# EAGLE design doorbell20 (EAGLE 7.2.0)
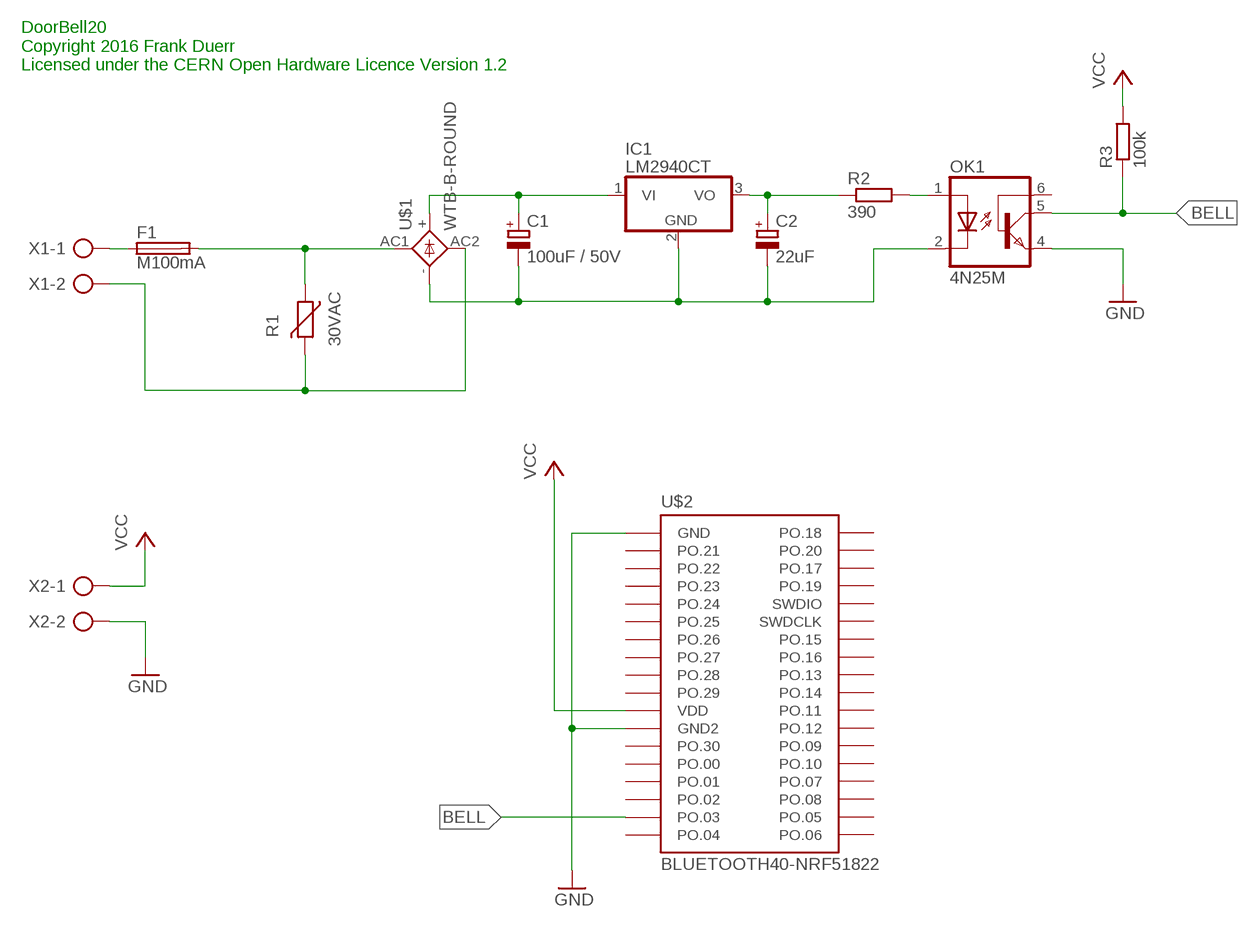
[diagram p0: schematic, sheet 1]

## Parts
C1  100uF / 50V  CPOL-EUE5-10.5  [E5-10,5]
C2  22uF  CPOL-EUE2.5-5  [E2,5-5]
F1  M100mA  FUSESH22,5A  [SH22,5A]
IC1  LM2940CT  7805TV  [TO220V]
OK1  4N25M  [DIL06]
R1  30VAC  VARISTOR-7,5  [R-7,5]
R2  390  R-EU_0207/7  [0207/7]
R3  100k  R-EU_0207/7  [0207/7]
U$1  WTB-B-ROUND  [WTE-B-ROUND]
U$2  BLUETOOTH40-NRF51822  [BLUETOOTH40-NR51822]
X1  AK500/2  [AK500/2]
X2  AK500/2  [AK500/2]

## Nets
BELL: OK1.5(COL) R3.1 U$2.PO.03
GND: OK1.4(EMI) U$2.GND U$2.GND2 X2.2
N$1: F1.1 X1.1
N$2: F1.2 R1.1 U$1.AC1
N$4: C1.- C2.- IC1.2(GND) OK1.2(C) U$1.-
N$5: C1.+ IC1.1(VI) U$1.+
N$6: OK1.1(A) R2.2
N$7: R1.2 U$1.AC2 X1.2
N$9: C2.+ IC1.3(VO) R2.1
VCC: R3.2 U$2.VDD X2.1
Unconnected: OK1.6(BAS) U$2.PO.00 U$2.PO.01 U$2.PO.02 U$2.PO.04 U$2.PO.05 U$2.PO.06 U$2.PO.07 U$2.PO.08 U$2.PO.09 U$2.PO.10 U$2.PO.11 U$2.PO.12 U$2.PO.13 U$2.PO.14 U$2.PO.15 U$2.PO.16 U$2.PO.17 U$2.PO.18 U$2.PO.19 U$2.PO.20 U$2.PO.21 U$2.PO.22 U$2.PO.23 U$2.PO.24 U$2.PO.25 U$2.PO.26 U$2.PO.27 U$2.PO.28 U$2.PO.29 U$2.PO.30 U$2.SWDCLK U$2.SWDIO

## Notes on the sheet
- DoorBell20
  Copyright 2016 Frank Duerr
  Licensed under the CERN Open Hardware Licence Version 1.2

## Library data of the parts
C1 C2 = rcl:CPOL-EU: POLARIZED CAPACITOR, European symbol
F1 = fuse:FUSE: Fuse; OC_FARNELL: unknown; OC_NEWARK: unknown
IC1 = linear:78*: Positive VOLTAGE REGULATOR Source: http://cache.national.com/ds/LM/LM78L05.pdf http://www.fairchildsemi.com/ds/LM/LM7805.pdf
OK1 = optocoupler:4N*?M: General Purpose 6-Pin Phototransistor Optocouplers Source: http://www.fairchildsemi.com/ds/4N/4N35-M.pdf; MPN: 4N25-M; OC_FARNELL: 1021349; OC_NEWARK: 98K9084
R1 = varistor:VARISTOR: VARISTOR
R2 R3 = rcl:R-EU_: RESISTOR, European symbol
U$1 = WTE-B:WTB-B-ROUND
U$2 = bluetooth40-nrf51822:BLUETOOTH40-NRF51822
X1 X2 = con-ptr500:AK500/2: CONNECTOR; OC_FARNELL: unknown; OC_NEWARK: unknown

## Board
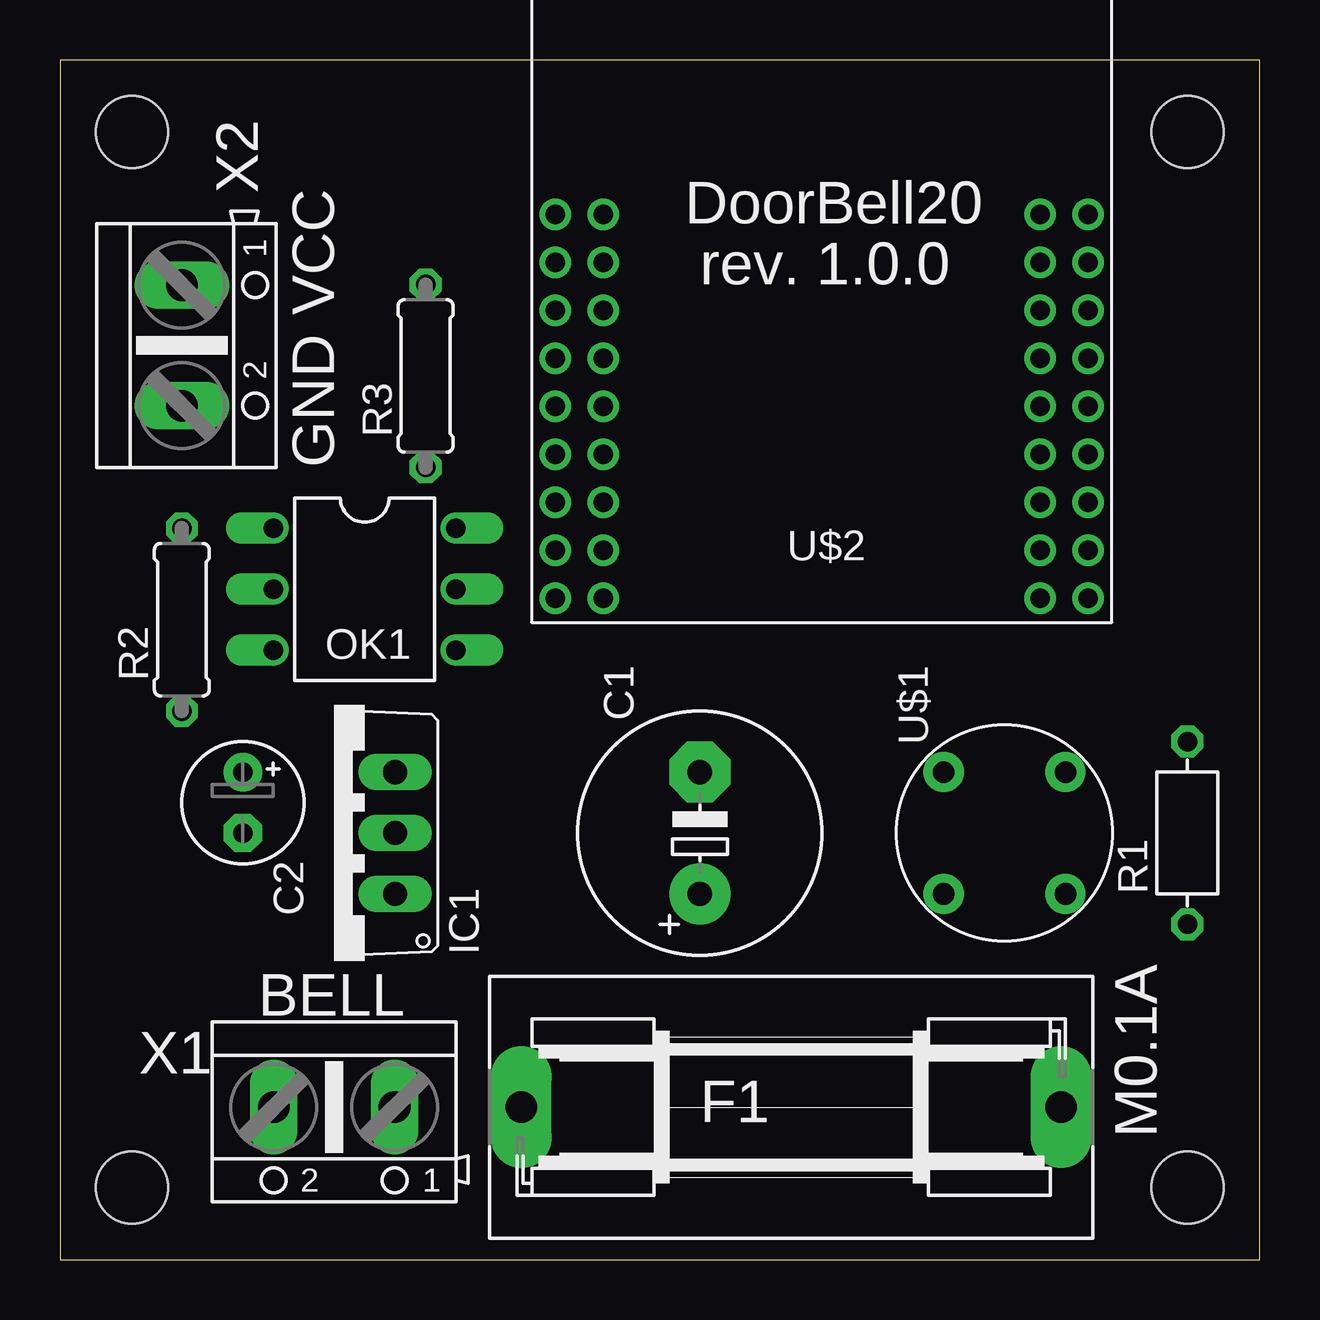
[diagram p1: board, top side]
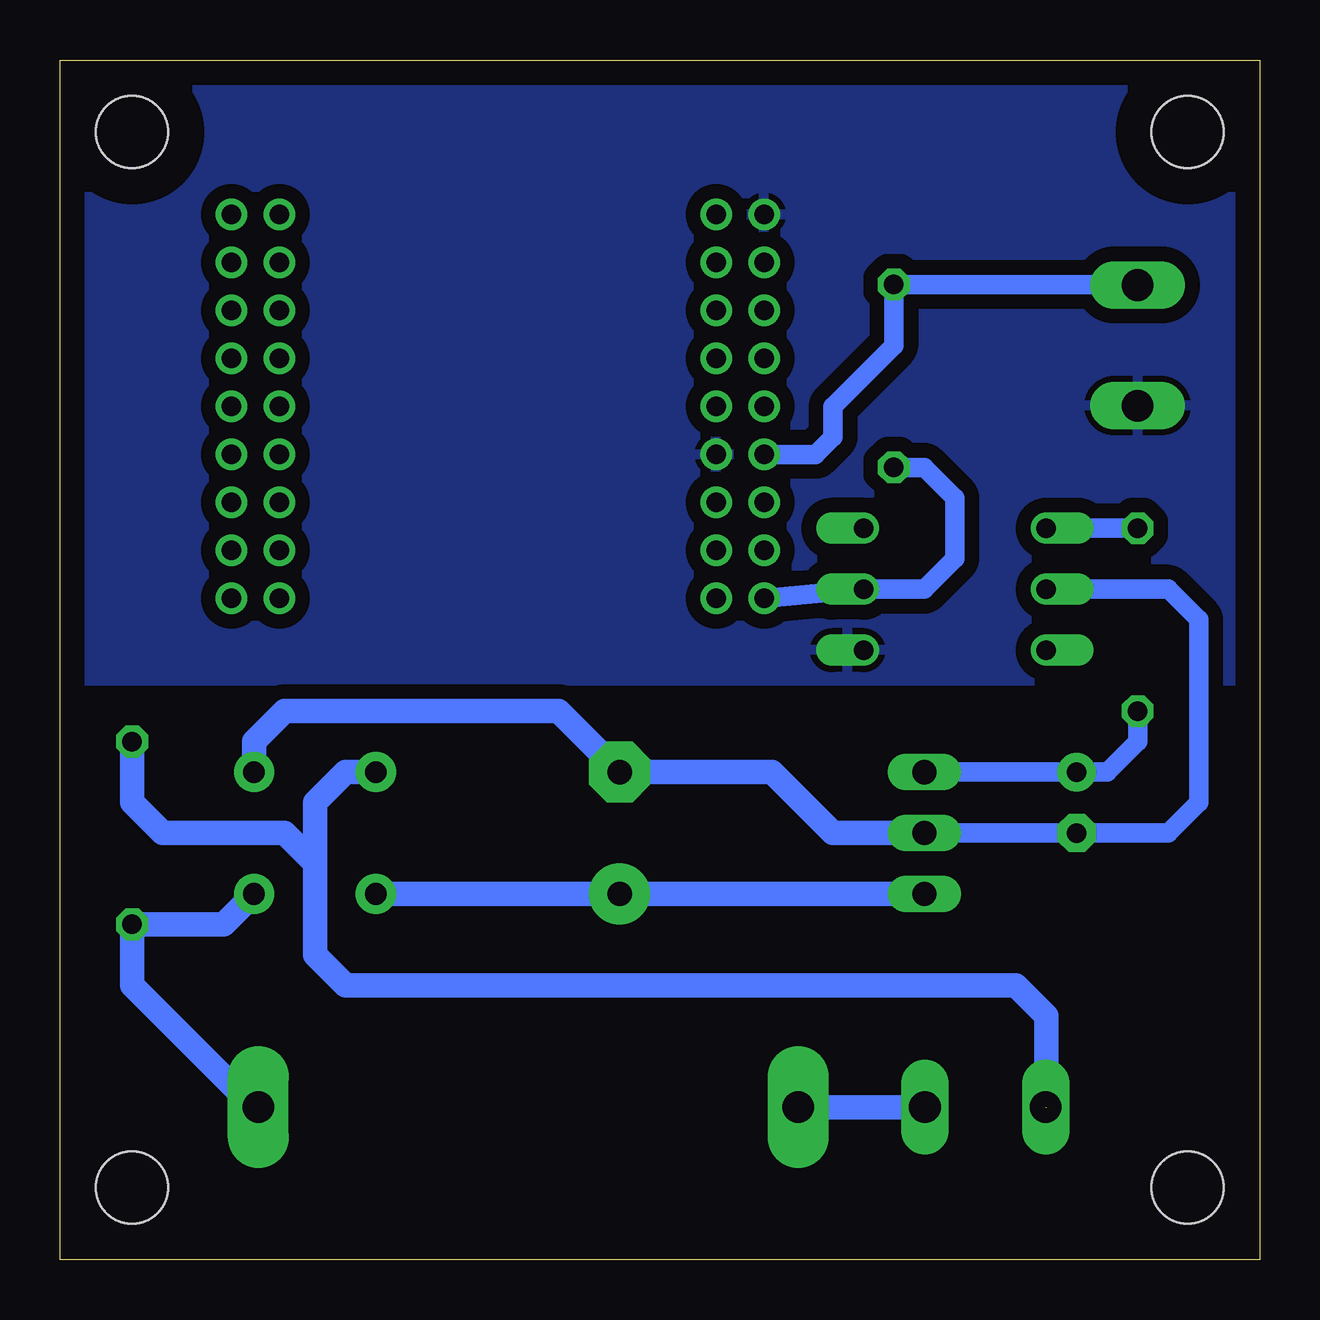
[diagram p2: board, bottom side, seen from below]

Size 50 x 50 mm. Coordinates in mm from the lower left corner, seen from the top.
Outline: 0,0 50,0 50,50 0,50 0,0
Copper layers (1*16): Top 0.035mm / dielectric 1.5mm / Bottom 0.035mm
Design rules "default *": minimum track width 10mil, minimum drill 24mil, track to track 24mil, track to pad 24mil, pad to pad 24mil, via to via 24mil, smd to smd 8mil, copper to edge 40mil, drill to drill 8mil, minimum pad ring 10mil, minimum via ring 8mil, stop-mask expansion 4mil, vias tented up to drill 0mil, thermal gap 10mil
Holes 3 mm at 3,3 47,3 3,47 47,47
bRestrict: area 0,44 to 6,50; area 44,44 to 50,50

### Footprints (pad centres in the part's own frame; a part is rotated, then mirrored left to right if it is on the bottom)
E5-10,5 = drill 1.016 pad 2.54: + -2.54,0 | drill 1.016 pad 2.54 octagon: - 2.54,0
E2,5-5 = drill 0.813 pad 1.6: + -1.27,0 | drill 0.813 pad 1.6 octagon: - 1.27,0
SH22,5A = drill 1.321 pad 2.54 long: 1 -11.252,0; 2 11.252,0
TO220V = drill 1.016 long: 1 -2.54,-2.54; 2 0,-2.54; 3 2.54,-2.54
DIL06 = drill 0.813 offset: 1 -2.54,-3.81; 2 0,-3.81; 3 2.54,-3.81; 4 2.54,3.81; 5 0,3.81; 6 -2.54,3.81
R-7,5 = drill 0.813 octagon: 1 -3.81,0; 2 3.81,0
0207/7 = drill 0.813 octagon: 1 -3.81,0; 2 3.81,0
WTE-B-ROUND = drill 0.9 pad 1.676: + 2.54,2.54; - -2.54,-2.54; AC1 -2.54,2.54; AC2 2.54,-2.54
BLUETOOTH40-NR51822 = drill 0.8: GND -11.1,8; GND2 -9.1,-2; PO.00 -9.1,-4; PO.01 -11.1,-6; PO.02 -9.1,-6; PO.03 -11.1,-8; PO.04 -9.1,-8; PO.05 9.1,-8; PO.06 11.1,-8; PO.07 9.1,-6; PO.08 11.1,-6; PO.09 9.1,-4; PO.10 11.1,-4; PO.11 9.1,-2; PO.12 11.1,-2; PO.13 9.1,0; PO.14 11.1,0; PO.15 9.1,2; PO.16 11.1,2; PO.17 9.1,6; PO.18 9.1,8; PO.19 11.1,6; PO.20 11.1,8; PO.21 -9.1,8; PO.22 -11.1,6; PO.23 -9.1,6; PO.24 -11.1,4; PO.25 -9.1,4; PO.26 -11.1,2; PO.27 -9.1,2; PO.28 -11.1,0; PO.29 -9.1,0; PO.30 -11.1,-4; SWDCLK 11.1,4; SWDIO 9.1,4; VDD -11.1,-2
AK500/2 = drill 1.321 long: 1 -2.515,0; 2 2.515,0

### Placement (x,y rotation side)
C1  26.67,17.78 90 top
C2  7.62,19.05 270 top
F1  30.48,6.35 0 top
IC1  11.43,17.78 90 top
OK1  12.7,27.94 270 top
R1  46.99,17.78 90 top
R2  5.08,26.67 90 top
R3  15.24,36.83 90 top
U$1  39.37,17.78 180 top
U$2  31.75,35.56 0 top
X1  11.43,6.35 180 top
X2  5.08,38.1 270 top

### Tracks (layer width: path | path; a pad name or v marks a point on that pad's centre or on a via)
BELL
  Bottom 0.813: U$2.PO.03 OK1.5 13.97,27.94 12.7,29.21 12.7,31.75 13.97,33.02 R3.1
GND
  pour Bottom: -1.27,52.07 52.07,52.07 53.34,52.07 53.34,24.13 -1.27,24.13
N$1
  Bottom 1.016: X1.1 F1.1
N$2
  Bottom 0.813: F1.2 41.91,6.35
  Bottom 1.016: U$1.AC1 43.18,13.97 R1.1 46.99,11.43 41.91,6.35
N$4
  Bottom 0.813: IC1.2 C2.- 3.81,17.78 2.54,19.05 2.54,26.67 3.81,27.94 OK1.2
  Bottom 1.016: U$1.- 41.91,21.59 40.64,22.86 29.21,22.86 C1.- 20.32,20.32 17.78,17.78 IC1.2
N$5
  Bottom 1.016: U$1.+ C1.+ IC1.1
N$6
  Bottom 0.813: R2.2 OK1.1
N$7  (1 unrouted)
  Bottom 1.016: 8.89,6.35 8.89,10.16 10.16,11.43 38.1,11.43 39.37,12.7 39.37,16.51 | 39.37,16.51 39.37,19.05 38.1,20.32 U$1.AC2 | 39.37,16.51 40.64,17.78 45.72,17.78 46.99,19.05 R1.2
N$9
  Bottom 0.813: IC1.3 C2.+ 6.35,20.32 5.08,21.59 R2.1
VCC
  Bottom 0.813: U$2.VDD 18.51,33.56 17.78,34.29 17.78,35.56 15.24,38.1 R3.2 5.11,40.64 X2.1

### Text on the board
tNames: DoorBell20 | rev. 1.0.0 | VCC | GND | BELL | M0.1A
Document: DoorBell20 / Copyright 2016 Frank Duerr / Licensed under the CERN Open Hardware Licence Version 1.2